# Altium schematic sheet BATTERY_CHARGER.SchDoc
size B; SheetNumber: 21; SheetTotal: 21
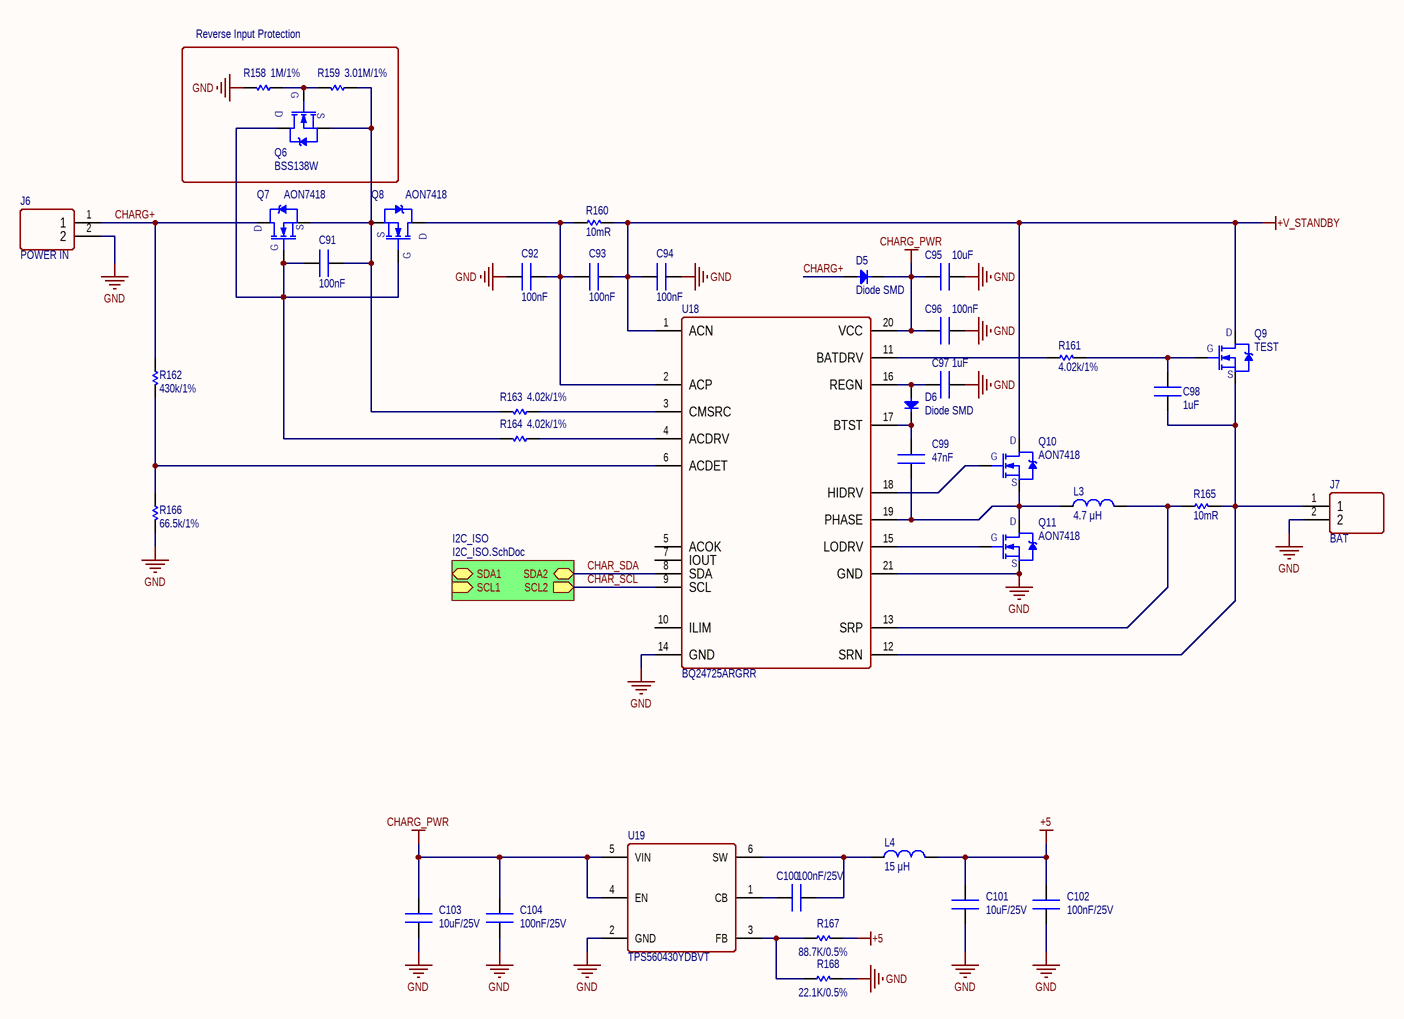
[diagram p0: BATTERY_CHARGER.SchDoc]

## Parts
C91  100nF  [CN-SMD-0603]
C92  100nF  [CN-SMD-0603]
C93  100nF  [CN-SMD-0603]
C94  100nF  [CN-SMD-0603]
C95  10uF  [CN-SMD-0603]
C96  100nF  [CN-SMD-0603]
C97  1uF  [CN-SMD-0603]
C98  1uF  [CN-SMD-0603]
C99  47nF  [CN-SMD-0603]
C100  100nF/25V  [CN-SMD-0603]
C101  10uF/25V  [CN-SMD-0603]
C102  100nF/25V  [CN-SMD-0603]
C103  10uF/25V  [CN-SMD-0603]
C104  100nF/25V  [CN-SMD-0603]
D5  Diode SMD  [DIO-SMD-323]
D6  Diode SMD  [DIO-SMD-323]
J6  POWER IN  [S2P-VH]
J7  BAT  [KF2-5.08]
L3  4.7 μH  [PSM1040]
L4  15 μH  [L-SMD-0630]
Q6  BSS138W  [DFN3.3x3.3_8L]
Q7  AON7418  [DFN3.3x3.3_8L]
Q8  AON7418  [DFN3.3x3.3_8L]
Q9  TEST  [DFN3.3x3.3_8L]
Q10  AON7418  [DFN3.3x3.3_8L]
Q11  AON7418  [DFN3.3x3.3_8L]
R158  1M/1%  [RES-SMD-0603]
R159  3.01M/1%  [RES-SMD-0603]
R160  10mR  [RES-SMD-1206]
R161  4.02k/1%  [RES-SMD-0603]
R162  430k/1%  [RES-SMD-0603]
R163  4.02k/1%  [RES-SMD-0603]
R164  4.02k/1%  [RES-SMD-0603]
R165  10mR  [RES-SMD-1206]
R166  66.5k/1%  [RES-SMD-0603]
R167  88.7K/0.5%  [RES-SMD-0603]
R168  22.1K/0.5%  [RES-SMD-0603]
U18  BQ24725ARGRR  [PQFN50P350X350X100_HS-21N]
U19  TPS560430YDBVT  [SOT23-6]

## Blocks framed on the sheet
Reverse Input Protection: Q6 R158 R159

## Sub-sheets
I2C_ISO = I2C_ISO.SchDoc: SDA1 (bidir), SCL1 (in), SDA2 (bidir), SCL2 (out)

## Nets
+5: C101.2 C102.2 L4.2 R167.2
+V_STANDBY: C93.1 C94.2 Q9.5,6,7,8,9(D) Q10.5,6,7,8,9(D) R160.2 U18.1(ACN)
CHARG_PWR: C95.2 C96.2 C103.2 C104.2 D5.2(K) U18.20(VCC) U19.4(EN) U19.5(VIN)
GND: C92.1 C94.1 C95.1 C96.1 C97.2 C101.1 C102.1 C103.1 C104.1 J6.2 J7.2 Q11.1,2,3(S) R158.2 R166.2 R168.2 U18.14(GND) U18.21(GND) U19.2(GND)
CHAR_SCL: U18.9(SCL) ; sheet I2C_ISO/SCL2
CHAR_SDA: U18.8(SDA) ; sheet I2C_ISO/SDA2
CHARG+: D5.1(A) J6.1 Q7.5,6,7,8,9(D) R162.1
NetC91_1: C91.1 Q6.1,2,3(S) Q7.1,2,3(S) Q8.1,2,3(S) R159.1 R163.2
NetC91_2: C91.2 Q6.5,6,7,8,9(D) Q7.4(G) Q8.4(G) R164.2
NetC92_2: C92.2 C93.2 Q8.5,6,7,8,9(D) R160.1 U18.2(ACP)
NetC97_1: C97.1 D6.1(A) U18.16(REGN)
NetC98_1: C98.1 J7.1 Q9.1,2,3(S) R165.2 U18.12(SRN)
NetC98_2: C98.2 Q9.4(G) R161.2
NetC99_1: C99.1 L3.1 Q10.1,2,3(S) Q11.5,6,7,8,9(D) U18.19(PHASE)
NetC99_2: C99.2 D6.2(K) U18.17(BTST)
NetC100_1: C100.1 L4.1 U19.6(SW)
NetC100_2: C100.2 U19.1(CB)
NetL3_2: L3.2 R165.1 U18.13(SRP)
NetQ6_4: Q6.4(G) R158.1 R159.2
NetQ10_4: Q10.4(G) U18.18(HIDRV)
NetQ11_4: Q11.4(G) U18.15(LODRV)
NetR161_1: R161.1 U18.11(BATDRV)
NetR162_2: R162.2 R166.1 U18.6(ACDET)
NetR163_1: R163.1 U18.3(CMSRC)
NetR164_1: R164.1 U18.4(ACDRV)
NetR167_1: R167.1 R168.1 U19.3(FB)

Not connected (* = marked no-connect by the designer): U18 5(ACOK) 7(IOUT) 10(ILIM)

## Library data of the parts
C91-C99 = CN: Value: 33pF
C100 C102 C104 = CN: CL10B104KA8NNNC; PN: CL10B104KA8NNNC
C101 C103 = CN: 0603W106M250XD; PN: 0603W106M250XD
D5 D6 = Diode SMD: Default Diode; Code - JEDEC: DO-214-AB; Value: 1N5007; Published: 8-Jun-2000; Revision: July-2002: Re-released for DXP Platform.; Publisher: Altium Limited
J6 J7 = KF2: Manufacturer: Würth Elektronik eiSos GmbH; partNo: 691103110002; ComponentLink1 Description: Manufacturer; ComponentLink2 Description: Datasheet; NoPins: 2; Created Date: 29 October 2013; ComponentLink1URL: http://www.we-online.com; ComponentLink2URL: http://katalog.we-online.de/em/datasheet/6911031100xx.pdf; Created by: Karrer Zheng
L3 L4 = L-SMD-1: partNo: 78477010; Manufacturer: Wurth Elektronik; ComponentLink1Description: Manufacturer; ComponentLink1URL: http://www.we-online.de; Created by: Baojun Chen; Created Date: Nov.2015; ComponentLink2Description: Datasheet; ComponentLink2URL: http://katalog.we-online.de/pbs/datasheet/78477010.pdf
  L3: Inductance: 4.7 μH
  L4: Inductance: 15 μH
Q6 = AON7292: AON7418; LCSC: -
Q7 Q8 Q10 Q11 = AON7292: LCSC: -
Q9 = AON7292: AON7421; LCSC: -
R158-R166 = Res-SMD: Resistor; Manufacturer: Generic Components; Class: Passive; Published: 08/06/2000; Publisher: Altium Hobart Technology Centre
R167 = Res-SMD: ERA-3AEB8872V; Manufacturer: Generic Components; Class: Passive; Published: 08/06/2000; Publisher: Altium Hobart Technology Centre
R168 = Res-SMD: ERA-3AED2212V; Manufacturer: Generic Components; Class: Passive; Published: 08/06/2000; Publisher: Altium Hobart Technology Centre
U18 = BQ24725ARGRR: Cell Li+ Battery SMBus Charge Controller with N-Channel Power MOSFET Selector / and Advanced Circuit Protection